# EAGLE design TX_RX_switch_MAX333_final (EAGLE 9.4.0)
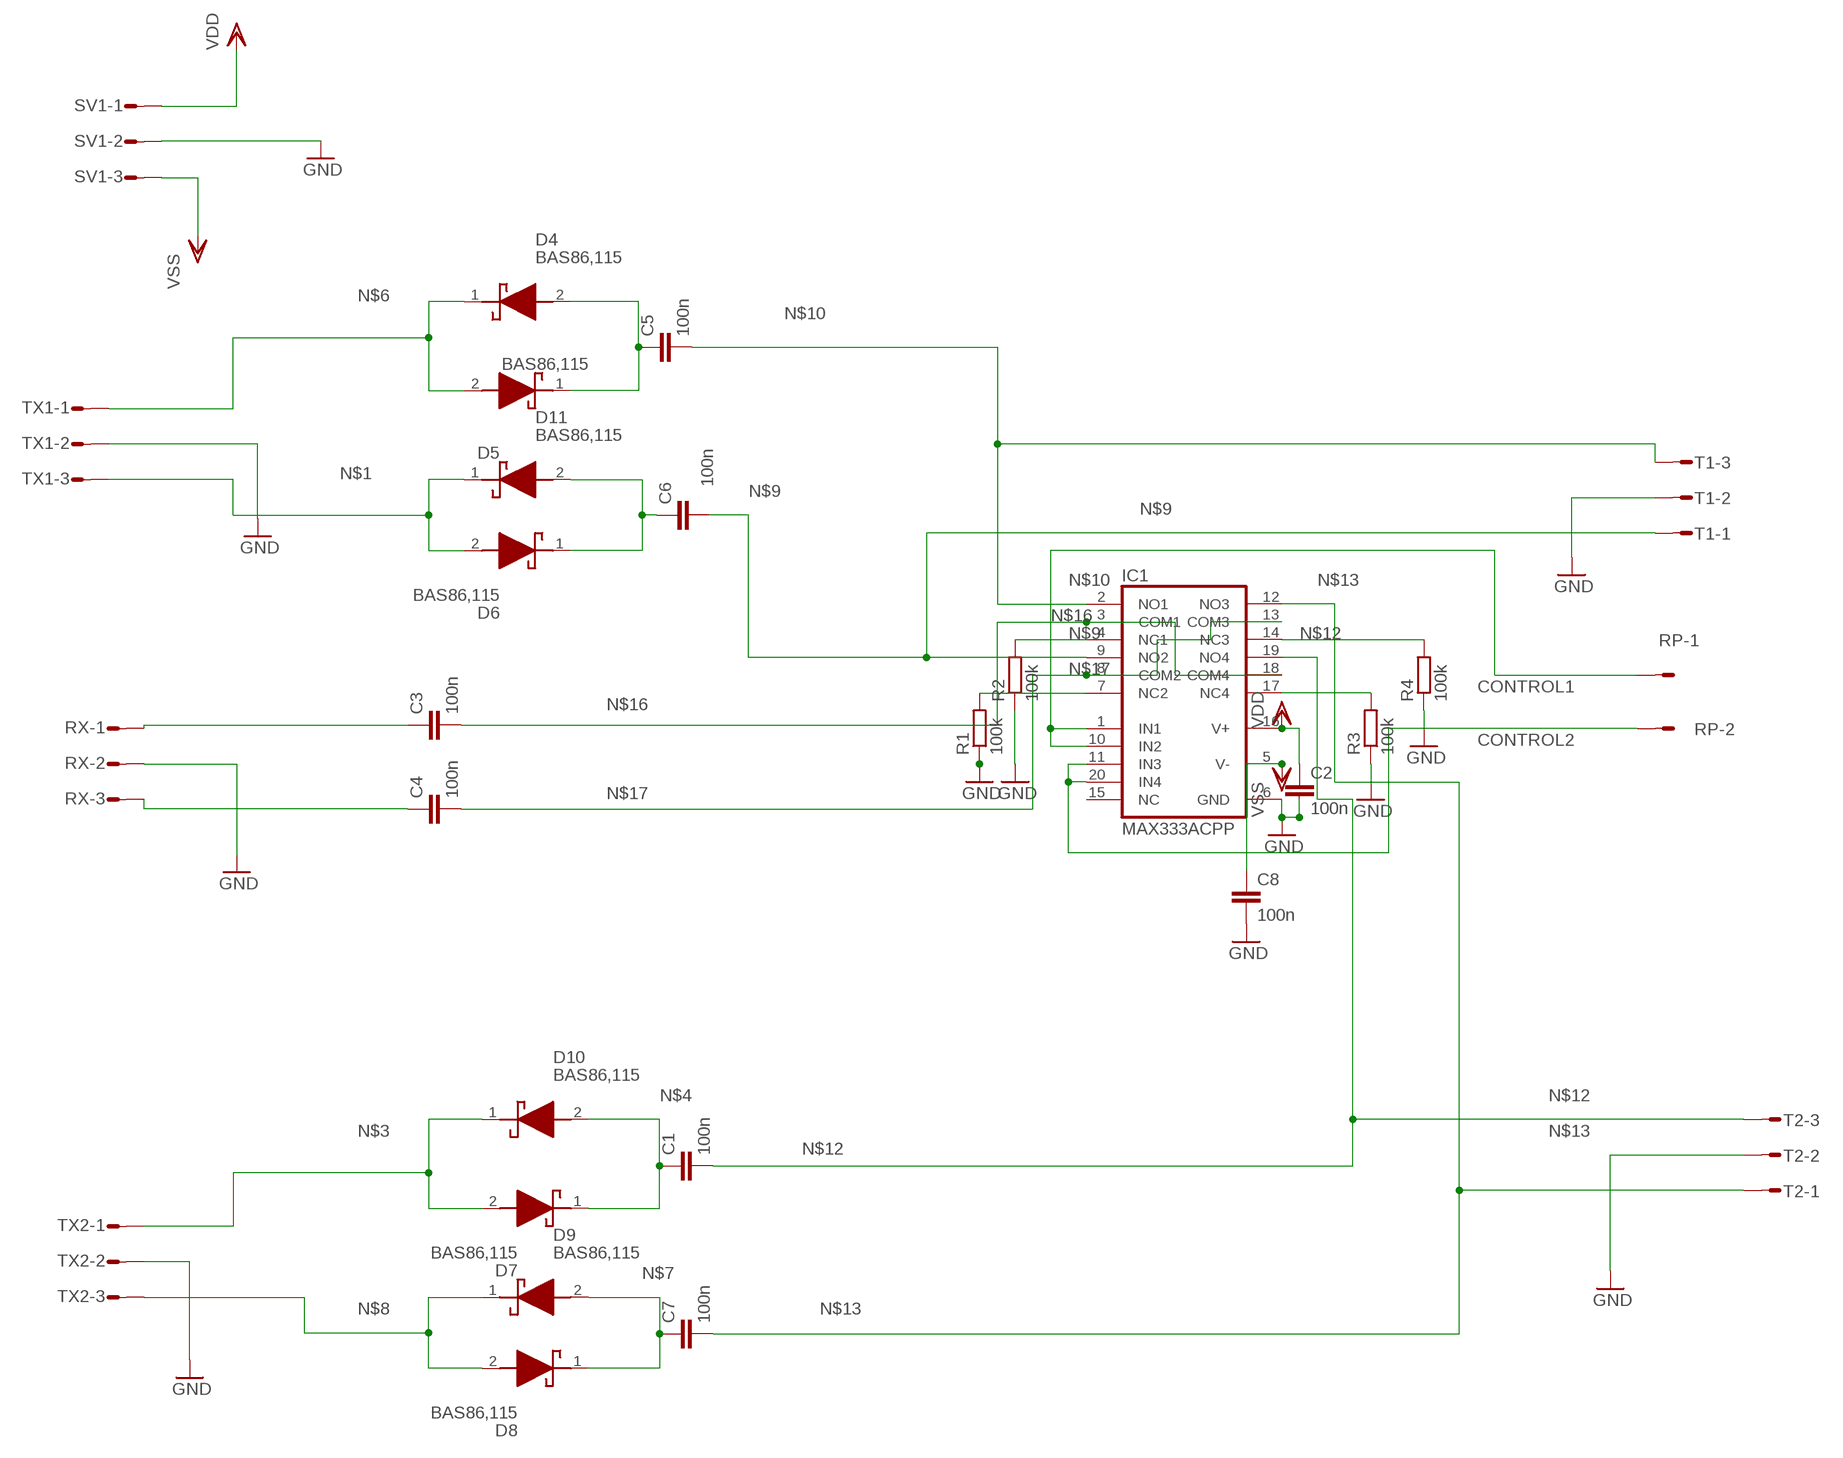
[diagram p0: schematic, sheet 1]

## Parts
C1  100n  C-EUC1206  [C1206]
C2  100n  C-EUC1206  [C1206]
C3  100n  C-EUC1206  [C1206]
C4  100n  C-EUC1206  [C1206]
C5  100n  C-EUC1206  [C1206]
C6  100n  C-EUC1206  [C1206]
C7  100n  C-EUC1206  [C1206]
C8  100n  C-EUC1206  [C1206]
D4  BAS86,115  [BAS86115]
D5  BAS86,115  [BAS86115]
D6  BAS86,115  [BAS86115]
D7  BAS86,115  [BAS86115]
D8  BAS86,115  [BAS86115]
D9  BAS86,115  [BAS86115]
D10  BAS86,115  [BAS86115]
D11  BAS86,115  [BAS86115]
IC1  MAX333ACPP  [DIL20]
R1  100k  R-EU_R1206  [R1206]
R2  100k  R-EU_R1206  [R1206]
R3  100k  R-EU_R1206  [R1206]
R4  100k  R-EU_R1206  [R1206]
RP  L02P  [L02P]
RX  L03P  [L03P]
SV1  L03P  [L03P]
T1  L03P  [L03P]
T2  L03P  [L03P]
TX1  L03P  [L03P]
TX2  L03P  [L03P]

## Nets
CONTROL1: IC1.1(IN1) IC1.10(IN2) RP.1
CONTROL2: IC1.11(IN3) IC1.20(IN4) RP.2
GND: C2.2 C8.2 IC1.6(GND) R1.1 R2.1 R3.1 R4.1
GND3: RX.2 SV1.2 T1.2 T2.2 TX1.2 TX2.2 ; supply symbol labelled GND
N$1: D6.2(A) D11.1(K) TX1.3
N$2: C6.1 D6.1(K) D11.2(A)
N$3: D7.2(A) D10.1(K) TX2.1
N$4: C1.1 D7.1(K) D10.2(A)
N$5: C5.1 D4.2(A) D5.1(K)
N$6: D4.1(K) D5.2(A) TX1.1
N$7: C7.1 D8.1(K) D9.2(A)
N$8: D8.2(A) D9.1(K) TX2.3
N$9: C6.2 IC1.9(NO2) T1.1
N$10: C5.2 IC1.2(NO1) T1.3
N$12: C1.2 IC1.19(NO4) T2.3
N$13: C7.2 IC1.12(NO3) T2.1
N$14: IC1.7(NC2) R1.2
N$15: C4.1 RX.3
N$16: C3.2 IC1.3(COM1) IC1.18(COM4)
N$17: C4.2 IC1.8(COM2) IC1.13(COM3)
N$18: C3.1 RX.1
N$19: IC1.4(NC1) R2.2
N$20: IC1.14(NC3) R4.2
N$21: IC1.17(NC4) R3.2
VDD: C2.1 IC1.16(V+) SV1.1
VSS: C8.1 IC1.5(V-) SV1.3
Unconnected: IC1.15(NC)

## Library data of the parts
C1-C8 = rcl:C-EU: CAPACITOR, European symbol; SPICEPREFIX: C
D4-D11 = BAS86_115:BAS86,115: Schottky Barrier Diode,50V,200mA,BAS86 Source: Datasheet <https://assets.nexperia.com/documents/data-sheet/BAS86.pdf>; DESCRIPTION: Schottky Barrier Diode,50V,200mA,BAS86; HEIGHT: 1.6mm; MANUFACTURER_NAME: Nexperia; MANUFACTURER_PART_NUMBER: BAS86,115; MOUSER_PART_NUMBER: 771-BAS86-T/R; MOUSER_PRICE-STOCK: https://www.mouser.co.uk/ProductDetail/Nexperia/BAS86115?qs=me8TqzrmIYUE5q3mGJwgiQ%3D%3D
IC1 = maxim:MAX333ACPP: ANALOG SWITCH; MF: MAXIM; MPN: MAX333ACPP; OC_FARNELL: unknown; OC_NEWARK: 77C9354
R1-R4 = rcl:R-EU_: RESISTOR, European symbol; SPICEPREFIX: R
RP = con-amp-mt:L02P: AMP MT CONNECTOR; OC_FARNELL: unknown; OC_NEWARK: unknown
RX SV1 T1 T2 TX1 TX2 = con-amp-mt:L03P: AMP MT CONNECTOR; OC_FARNELL: unknown; OC_NEWARK: unknown

## Board
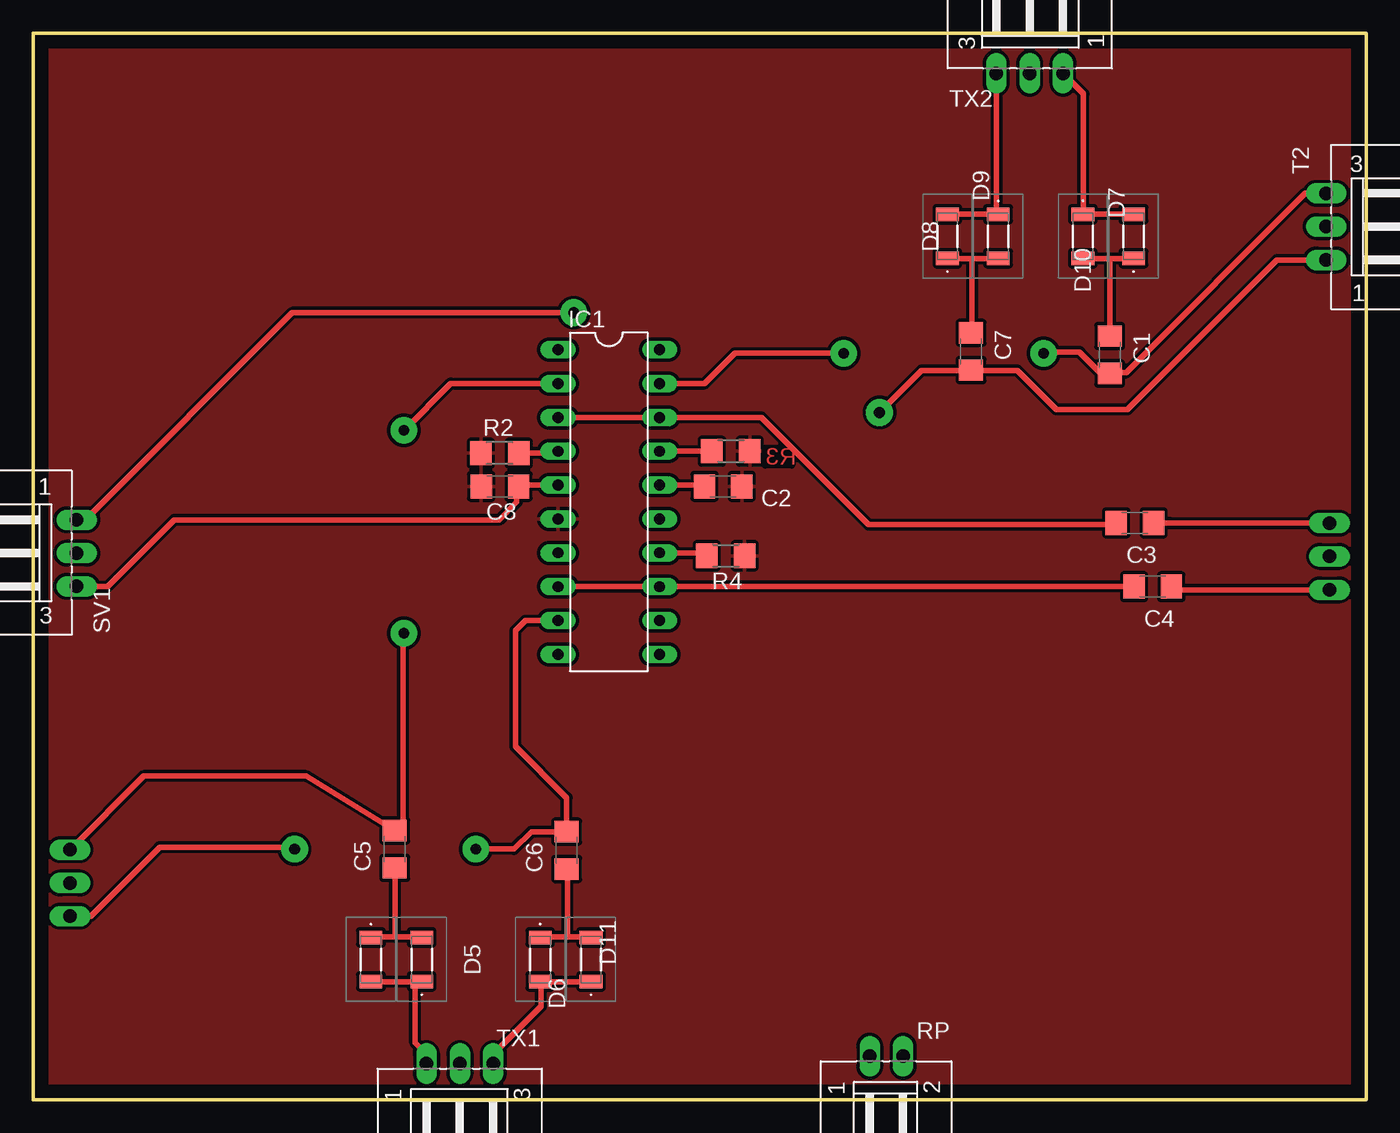
[diagram p1: board, top side]
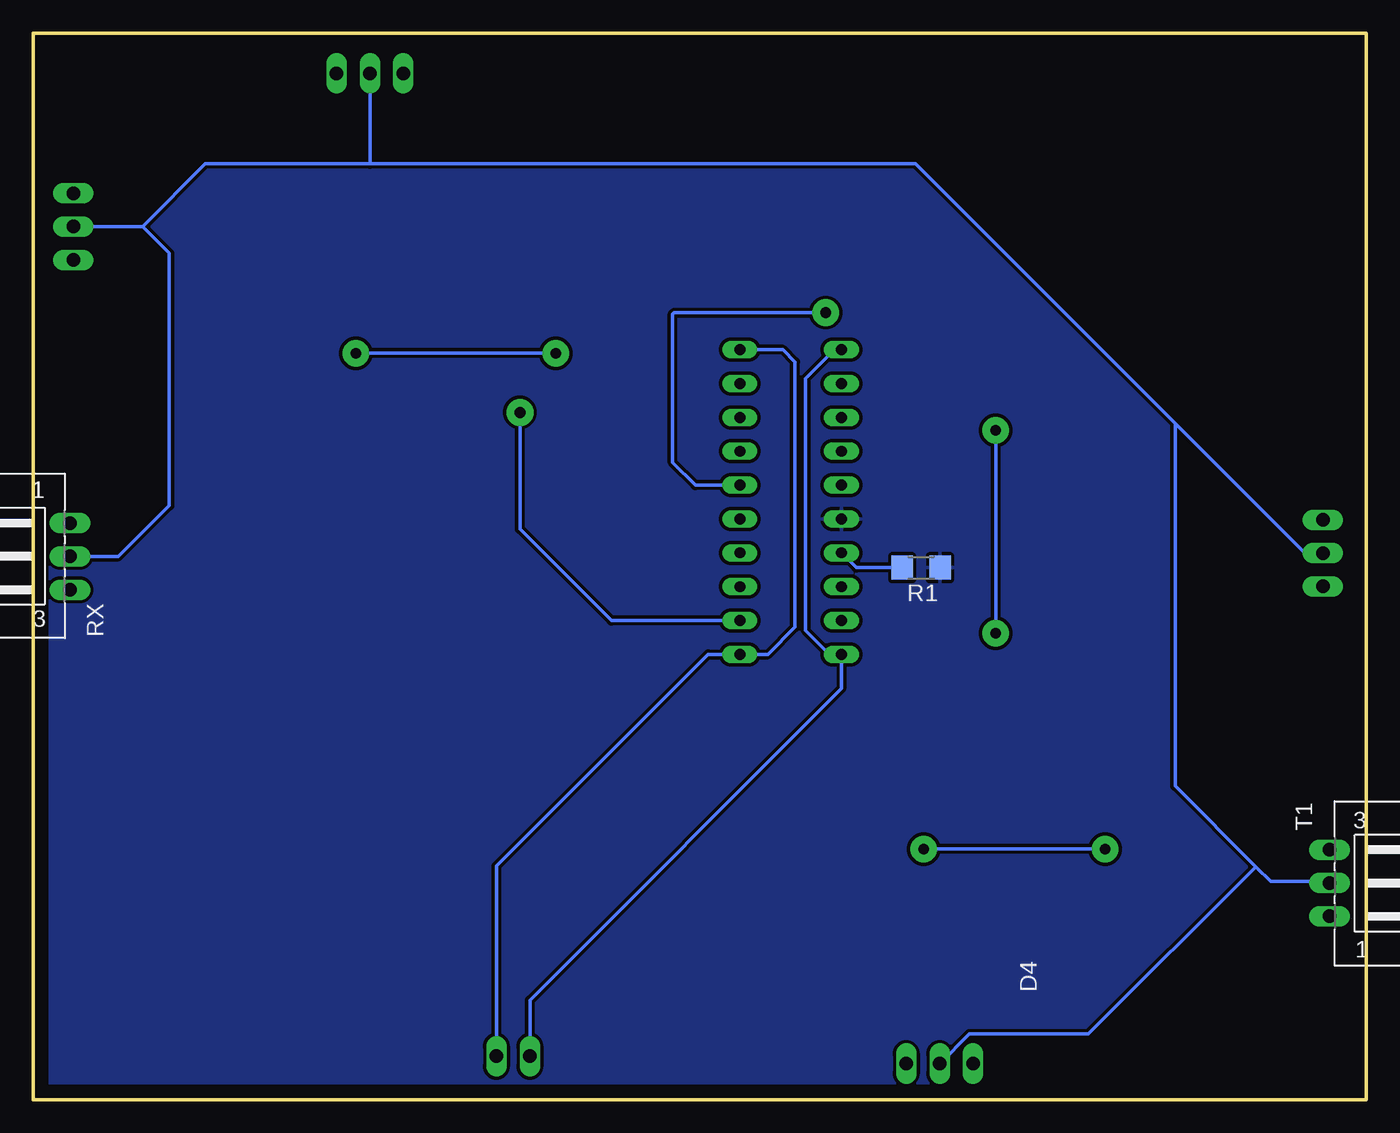
[diagram p2: board, bottom side, seen from below]

Size 100 x 80 mm. Coordinates in mm from the lower left corner, seen from the top.
Outline: 0,0 100,0 100,80 0,80 0,0
Copper layers (1*16): Top 0.035mm / dielectric 1.5mm / Bottom 0.035mm
Design rules "default *": minimum track width 10mil, minimum drill 0.8mm, track to track 10mil, track to pad 6mil, pad to pad 6mil, via to via 6mil, smd to smd 6mil, copper to edge 40mil, drill to drill 6mil, minimum pad ring 10mil, minimum via ring 8mil, stop-mask expansion 4mil, vias tented up to drill 0mil, thermal gap 10mil

### Footprints (pad centres in the part's own frame; a part is rotated, then mirrored left to right if it is on the bottom)
C1206 = smd 1.6 x 1.8: 1 -1.4,0; 2 1.4,0
BAS86115 = smd 1 x 1.7: 1 -1.65,0; 2 1.65,0
DIL20 = drill 0.813 long: 1 -11.43,-3.81; 2 -8.89,-3.81; 3 -6.35,-3.81; 4 -3.81,-3.81; 5 -1.27,-3.81; 6 1.27,-3.81; 7 3.81,-3.81; 8 6.35,-3.81; 9 8.89,-3.81; 10 11.43,-3.81; 11 11.43,3.81; 12 8.89,3.81; 13 6.35,3.81; 14 3.81,3.81; 15 1.27,3.81; 16 -1.27,3.81; 17 -3.81,3.81; 18 -6.35,3.81; 19 -8.89,3.81; 20 -11.43,3.81
R1206 = smd 1.6 x 1.803: 1 -1.422,0; 2 1.422,0
L02P = drill 1.016 long: 1 1.25,-6.25; 2 -1.25,-6.25
L03P = drill 1.016 long: 1 2.5,-6.25; 2 0,-6.25; 3 -2.5,-6.25

### Placement (x,y rotation side)
C1  80.76,55.88 270 top
C2  51.75,46 0 top
C3  82.65,43.27 180 top
C4  83.98,38.48 180 top
C5  27.12,18.78 90 top
C6  40.02,18.7 90 top
C7  70.35,56.13 270 top
C8  35,46 180 top
D4  29.14,10.51 90 top
D5  25.33,10.51 270 top
D6  38.03,10.51 270 top
D7  82.55,64.77 90 top
D8  68.58,64.77 90 top
D9  72.39,64.77 270 top
D10  78.74,64.77 270 top
D11  41.84,10.51 90 top
IC1  43.18,44.83 270 top
R1  33.4,39.91 180 bottom
R2  35,48.5 0 top
R3  52.33,48.65 180 top
R4  51.95,40.8 180 top
RP  64,-3 180 top
RX  103.5,40.75 90 bottom
SV1  -3,41 90 top
T1  -3.5,16.25 270 bottom
T2  103.25,65.5 270 top
TX1  32,-3.55 180 top
TX2  74.75,83.25 0 top

### Tracks (layer width: path | path; a pad name or v marks a point on that pad's centre or on a via)
CONTROL1
  Bottom 0.254: IC1.1 39.9,56.26 42.05,54.1 42.05,35.2 40.26,33.4 IC1.10 39.37,30.85 39.37,30.83 62.75,7.45 RP.1
CONTROL2
  Bottom 0.254: IC1.20 43.77,56.26 42.85,55.34 42.85,35.45 44.9,33.4 IC1.11 49.38,33.4 65.25,17.53 RP.2
GND
  pour Top: -5.5,83.5 -5.5,-6.5 106.75,-6.5 106.75,86.25 -5.5,86.25
  pour Bottom: -3.5,82.5 -3.5,-2.5 103.5,-2.5 103.5,84 101.75,84 -3.5,84
GND3
  Bottom 0.254: TX1.2 29.78,4.92 20.84,4.92 8.33,17.43 8.23,17.43 | T2.2 91.8,65.5 | 91.8,65.5 89.8,63.5 89.8,44.56 93.61,40.75 RX.2 | T1.2 2.85,16.35 7.15,16.35 8.23,17.43 | SV1.2 4.62,41 14.32,50.71 | 14.32,50.71 33.83,70.21 74.75,70.21 | 91.8,65.5 87.09,70.21 74.75,70.21 | TX2.2 74.75,70.21 | 14.32,50.71 14.32,23.52 8.23,17.43
N$1
  Top 0.406: 38.1,8.84 41.76,8.84 D11.1 | 38.1,8.84 38.1,7.01 34.59,3.5 34.59,2.79 TX1.3 | 38.1,8.84 D6.2
N$2
  Top 0.406: 40.08,12.19 41.76,12.19 D11.2 | 40.08,12.19 38.1,12.19 D6.1 | 40.08,12.19 40.08,17.22 C6.1
N$3
  Top 0.406: 78.79,66.45 82.45,66.45 D7.2 | 78.79,66.45 D10.1 | TX2.1 78.79,75.46 78.79,66.45
N$4
  Top 0.406: 80.77,63.09 82.45,63.09 D7.1 | 80.77,63.09 78.79,63.09 D10.2 | 80.77,63.09 80.77,57.3 C1.1
N$5
  Top 0.406: 27.13,12.19 29.11,12.19 D4.2 | 27.13,12.19 25.45,12.19 D5.1 | 27.13,12.19 C5.1
N$6
  Top 0.406: 28.65,8.84 29.11,8.84 D4.1 28.65,8.84 | 28.65,8.84 25.45,8.84 D5.2 | 28.65,8.84 28.65,4.27 29.41,3.5 29.41,2.79 TX1.1
N$7
  Top 0.406: 70.41,63.09 72.39,63.09 D9.2 | 70.41,63.09 68.58,63.09 D8.1 | 70.41,63.09 70.41,57.61 C7.1
N$8
  Top 0.406: D8.2 68.58,66.45 72.39,66.45 D9.1 72.25,66.56 TX2.3
N$9  (via drill 0.8 pad 2)
  Top 0.406: IC1.9 36.92,35.94 36.17,35.19 36.17,26.49 40.02,22.64 C6.2 37.37,20.1 36.07,18.8 v33.2,18.8 | v19.6,18.8 19.48,18.92 9.48,18.92 4.3,13.75 T1.1
  Bottom 0.254: v19.6,18.8 v33.2,18.8
N$10  (via drill 0.8 pad 2)
  Top 0.406: v27.8,35 27.74,34.94 27.74,20.88 27.13,20.27 C5.2 20.46,24.27 8.27,24.27 T1.3 | IC1.2 31.32,53.72 v27.8,50.2
  Bottom 0.254: v27.8,35 v27.8,50.2
N$12  (via drill 0.8 pad 2)
  Top 0.406: v75.8,56 75.88,56.08 78.49,56.08 80.01,54.56 80.62,54.56 C1.2 80.77,54.56 81.99,54.56 95.43,68 T2.3 | v60.8,56 52.64,56 50.36,53.72 IC1.19
  Bottom 0.254: v60.8,56 v75.8,56
N$13  (via drill 0.8 pad 2)
  Top 0.406: v63.48,51.55 66.65,54.71 70.26,54.71 C7.2 70.41,54.71 73.82,54.71 76.76,51.78 82.08,51.78 93.3,63 T2.1
  Bottom 0.254: v63.48,51.55 63.48,42.8 56.63,35.94 IC1.12
N$14
  Bottom 0.254: R1.2 38.26,39.91 IC1.7
N$15
  Top 0.406: RX.3 85.61,38.25 C4.1
N$16
  Top 0.406: IC1.3 IC1.18 54.62,51.18 62.67,43.13 81.11,43.13 C3.2
N$17
  Top 0.406: IC1.8 IC1.13 C4.2 | C4.2
N$18
  Top 0.406: RX.1 85.29,43.25 85.27,43.27 C3.1
N$19
  Top 0.406: IC1.4 39.23,48.5 R2.2
N$20
  Top 0.406: IC1.14 50.31,41.02 R4.2
N$21
  Top 0.406: IC1.17 47,48.65 R3.2
VDD  (via drill 0.8 pad 2)
  Top 0.406: SV1.1 3.88,43.5 19.42,59.04 v40.56,59.04 | SV1.1 | IC1.16 50.25,46.1 C2.1
  Bottom 0.254: IC1.16 50.32,46.1 52.03,47.81 52.03,58.93 51.92,59.04 v40.56,59.04
VSS
  Top 0.406: SV1.3 5.59,38.5 10.58,43.49 34.94,43.49 36.27,44.82 36.27,45.87 C8.1 36.5,46.1 IC1.5